# Altium project FTDI_Dynamixel_Board_2025.PrjPcb
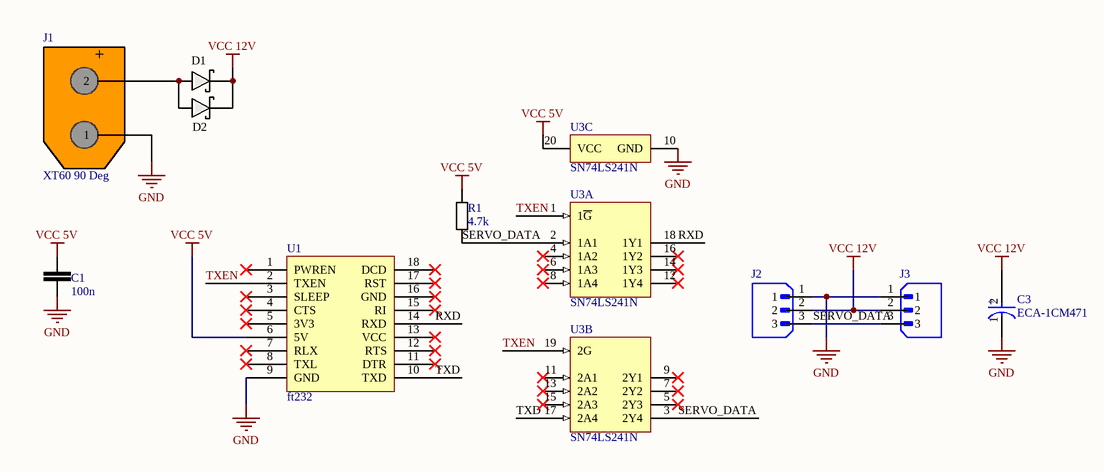
[diagram p0: FTDI_Dynamixel_Board_2025.SchDoc]
1 sheet, 10 parts. Net scope: global (net labels, ports and power ports of the same name join across sheets).
Board file: FTDI_Dynamixel_Board_2025.PcbDoc

## Sheet FTDI_Dynamixel_Board_2025.SchDoc
size A4; SheetNumber: 1; SheetTotal: 1

### Parts
C1  100n  [CAP_0805]
C3  ECA-1CM471  [FP-ECA-1CM471-MFG]
D1  SS14  [SMA]  (value not drawn)
D2  SS14  [SMA]  (value not drawn)
J1  XT60 90 Deg  [XT60PW-M]
J2  B3B-XH-A(LF)(SN)  [JST_B3B-XH-A(LF)(SN)]  (value not drawn)
J3  B3B-XH-A(LF)(SN)  [JST_B3B-XH-A(LF)(SN)]  (value not drawn)
R1  4.7k  [RESISTOR_0805_SMALLSILK]
U1  ft232  [ft232modull]
U3  SN74LS241N  [N0020A]  (parts A,B,C of 3)

### Nets
GND: C1.1 C3.1(C) J1.1 J2.1 J3.1 U1.9(GND) U3.10(GND)
VCC 5V: C1.2 R1.2 U1.6(5V) U3.20(VCC)
VCC 12V: C3.2(A) D1.2 D2.2 J2.2 J3.2
RXD: U1.14(RXD) U3.18(1Y1)
SERVO_DATA: J2.3 J3.3 R1.1 U3.2(1A1) U3.3(2Y4)
TXD: U1.10(TXD) U3.17(2A4)
TXEN: U1.2(TXEN) U3.1(1~{G}) U3.19(2G)
NetD1_1: D1.1 D2.1 J1.2

Not connected (* = marked no-connect by the designer): U1 1(PWREN)* 3(SLEEP)* 4(CTS)* 5(3V3)* 7(RLX)* 8(TXL)* 11(DTR)* 12(RTS)* 13(VCC)* 15(RI)* 16(GND)* 17(RST)* 18(DCD)*; U3 4(1A2)* 5(2Y3)* 6(1A3)* 7(2Y2)* 8(1A4)* 9(2Y1)* 11(2A1)* 12(1Y4)* 13(2A2)* 14(1Y3)* 15(2A3)* 16(1Y2)*

### Notes on the sheet
- (in symbol CMP-05427-000068-1) +
- (in symbol XT60PW-M) +

### Library data of the parts
C1 = C00079: CAP 100nF ±10% 50V 0805 X7R; capacitance: 100n
C3 = CMP-05427-000068-1: CAP ALUM 470UF 20% 16V RADIAL; Life (Hours): 2000Hour; Lead/Base Style: Straight; Lead Diameter: 0.6mm; Leakage Current: 3uA; Ripple Current: 440mA; Polarity: Polar; Dissipation Factor: 0.2%; Tolerance: 20%; Package Quantity: 200; Mount: Through Hole; Contact Plating: Tin; Max Operating Temperature: 85°C; Voltage Rating (DC): 16V; Min Operating Temperature: -40°C; Case/Package: Radial; Voltage: 16V; Diameter: 8mm; REACH SVHC: No SVHC; Number of Pins: 2; Series: M; Termination: Radial; Construction: RADIAL; Length: 11.5mm; Voltage Rating: 16V; Capacitance: 470uF; Packaging: Bulk; Height: 11.5mm; Lead Pitch: 3.5mm; Height - Seated (Max): 0.492inch; Radiation Hardening: No
D1 D2 = SCH_DIODE
J1 = XT60PW-M
J2 J3 = B3B-XH-A(LF)(SN): Connector Header Through Hole 3 position 0.098 (2.50mm); MF: JST Sales; SnapEDA_Link: https://www.snapeda.com/parts/B3B-XH-A(LF)(SN)/JST/view-part/?ref=snap; Package: None; Value: *; MP: B3B-XH-A(LF)(SN); Check_prices: https://www.snapeda.com/parts/B3B-XH-A(LF)(SN)/JST/view-part/?ref=eda
R1 = R000116: RES  4k7 OHM 1% 1/8W 0805; resistance: 4.7k
U3 = CMP-0440-00144-3: Octal Buffers And Line Drivers With 3-State Outputs, N0020A, TUBE; Manufacturer: Texas Instruments; Voltage(Nom)(V): 5; Input Type: TTL; F @ Nom Voltage(Max)(Mhz): 35; tpd @ Nom Voltage(Max)(ns): 18; Bits(#): 8; VCC(Min)(V): 4.75; Rating: Catalog; VCC(Max)(V): 5.25; ICC @ Nom Voltage(Max)(mA): 0.046; Generic Part Number: SN74LS241; Code_JEDEC: MS-001; Operating Temperature Range(C): 0 to 70; PackageVersion: http://www.ti.com/lit/ml/mpdi002c/mpdi002c.pdf; PackageReference: N0020A; Output Type: TTL; DatasheetVersion: SDLS144C